# Altium schematic sheet 14-RegenSolenoid.SchDoc
size A4
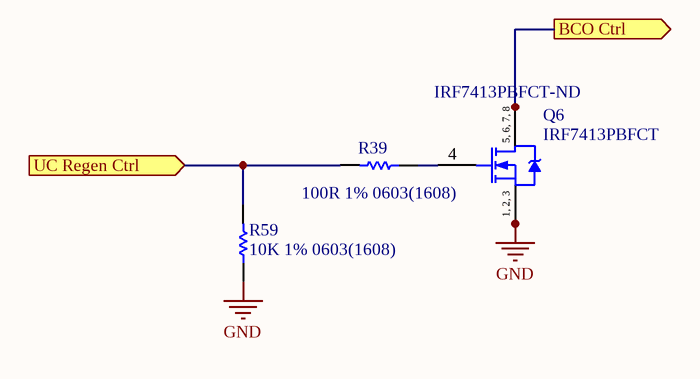
[diagram p0: 14-RegenSolenoid.SchDoc]

## Parts
Q6  IRF7413PBFCT  Supplier Part Number 1: IRF7413PBFCT-ND  [INTR-SO-8_V]
R39  100R 1% 0603(1608)  [RESC0603(1608)_N]
R59  10K 1% 0603(1608)  [RESC0603(1608)_N]

## Ports
BCO Ctrl (out), UC Regen Ctrl (in)

## Nets
GND: Q6.1(S) Q6.2(S) Q6.3(S) R59.1
BCO Ctrl: Q6.5(D) Q6.6(D) Q6.7(D) Q6.8(D) ; port BCO Ctrl
UC Regen Ctrl: R39.2 R59.2 ; port UC Regen Ctrl
NetQ6_4: Q6.4(G) R39.1

## Notes on the sheet
- (in symbol CMP-2000-06466-1) 5, 6, 7, 8; 1, 2, 3

## Library data of the parts
Q6 = CMP-2000-06466-1: HEXFET (R) Power MOSFET, 30 V, -55 to 150 degC, 8-Pin SO, RoHS, Tube; Manufacturer: International Rectifier; Rated Power Dissipation: 2.5W; Qg Gate Charge: 52nC; Channel Type: N-Channel; Drain-to-Source Voltage [Vdss]: 30V; Drain-Source On Resistance-Max: 0.011O; Mounting Technology: SurfaceMount; Datasheet URL: http://www.infineon.com/dgdl/irf7413pbf.pdf?fileId=5546d462533600a4015355fa8e901bb8; Package Description: 8-Pin Small Outline Integrated Circuit, Body 4.9 x 3.9 mm, Pitch 1.27 mm; Package Reference: SO-8; Datasheet Version: 02/2008; Manufacturer URL: http://internationalrectifier.com/; Supplier 1: Digi-Key
R39 = CMP-1012-00397-1: 100R 0.1W 1% 0603 (1608 Metric)  SMD; Value: 100.00 Ohm; Case-EIA: 0603; Case-Metric: 1608; Technology: SMT; Tolerance: 1 %; Power: 0.1 W
R59 = CMP-1012-00623-1: 10K 0.1W 1% 0603 (1608 Metric)  SMD; Value: 10000.00 Ohm; Case-EIA: 0603; Case-Metric: 1608; Power: 0.1 W; Tolerance: 1 %; Technology: SMT